# EAGLE design Controller (EAGLE 7.2.0)
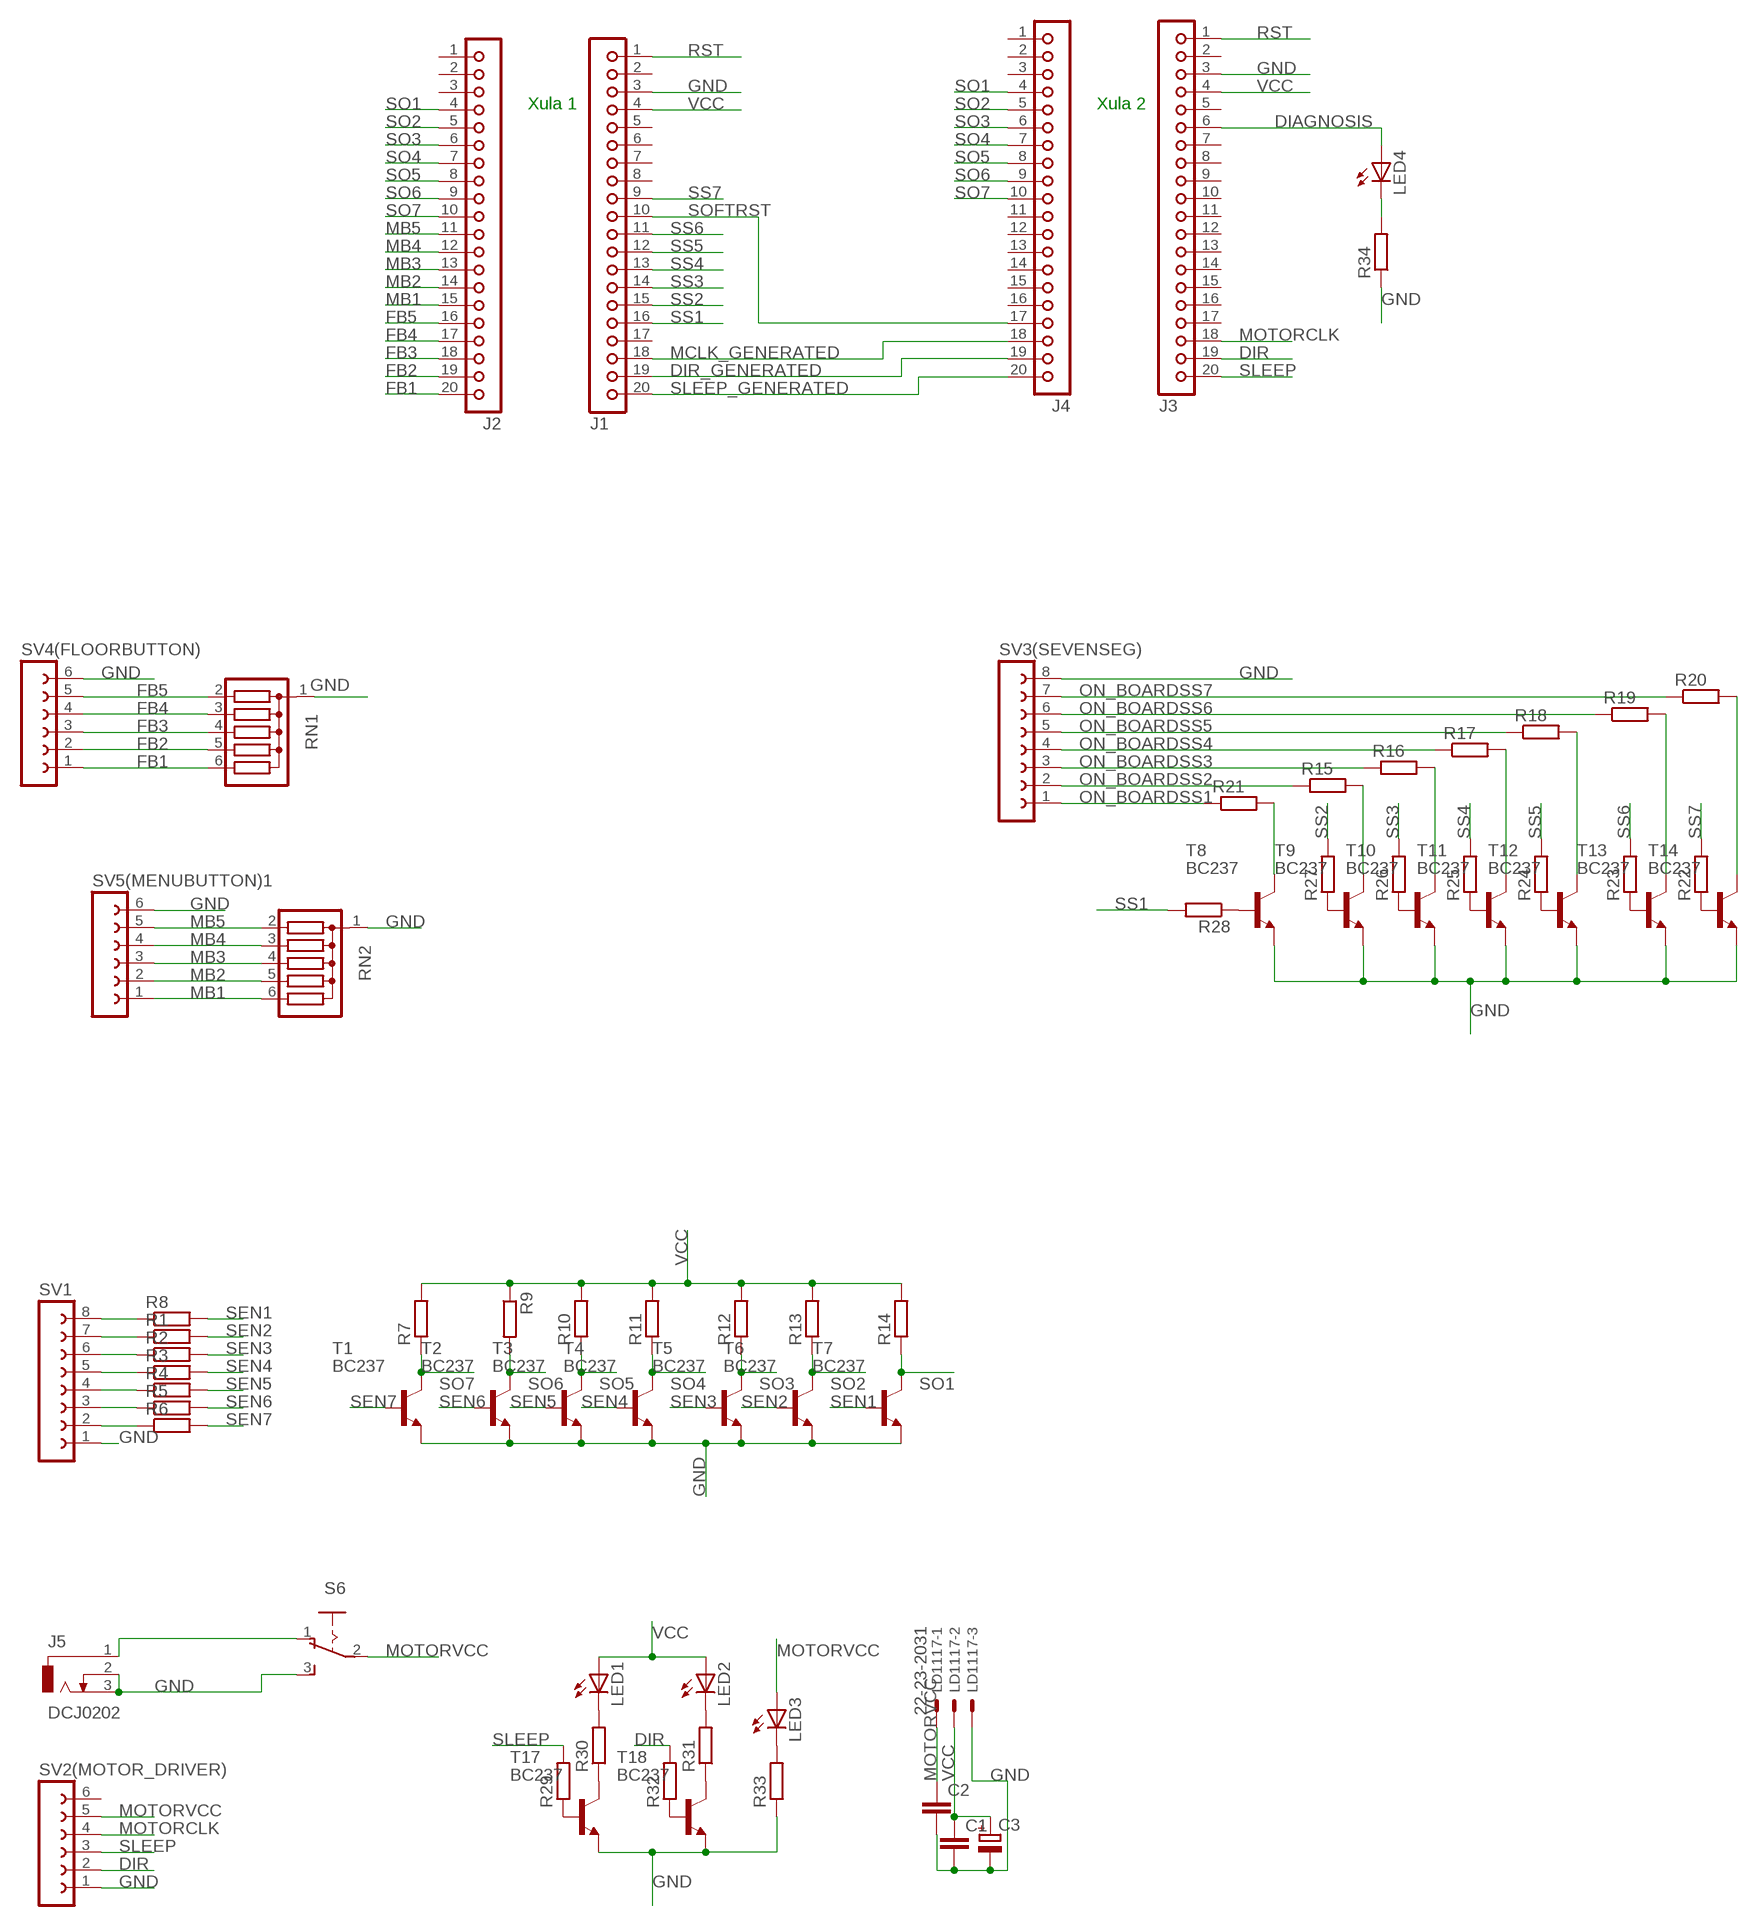
[diagram p0: schematic, sheet 1]

## Parts
C1  C-EU025-025X050  [C025-025X050]
C2  C-EU025-025X050  [C025-025X050]
C3  CPOL-EUE3.5-8  [E3,5-8]
J1  JBK20  [JBK20]
J2  JBK20  [JBK20]
J3  JBK20  [JBK20]
J4  JBK20  [JBK20]
J5  DCJ0202  [DCJ0202]
LD1117  22-23-2031  [22-23-2031]
LED1  LED3MM  [LED3MM]
LED2  LED3MM  [LED3MM]
LED3  LED3MM  [LED3MM]
LED4  LED3MM  [LED3MM]
R1  R-EU_0204/5  [0204/5]
R2  R-EU_0204/5  [0204/5]
R3  R-EU_0204/5  [0204/5]
R4  R-EU_0204/5  [0204/5]
R5  R-EU_0204/5  [0204/5]
R6  R-EU_0204/5  [0204/5]
R7  R-EU_0204/5  [0204/5]
R8  R-EU_0204/5  [0204/5]
R9  R-EU_0204/5  [0204/5]
R10  R-EU_0204/5  [0204/5]
R11  R-EU_0204/5  [0204/5]
R12  R-EU_0204/5  [0204/5]
R13  R-EU_0204/5  [0204/5]
R14  R-EU_0204/5  [0204/5]
R15  R-EU_0204/5  [0204/5]
R16  R-EU_0204/5  [0204/5]
R17  R-EU_0204/5  [0204/5]
R18  R-EU_0204/5  [0204/5]
R19  R-EU_0204/5  [0204/5]
R20  R-EU_0204/5  [0204/5]
R21  R-EU_0204/5  [0204/5]
R22  R-EU_0204/5  [0204/5]
R23  R-EU_0204/5  [0204/5]
R24  R-EU_0204/5  [0204/5]
R25  R-EU_0204/5  [0204/5]
R26  R-EU_0204/5  [0204/5]
R27  R-EU_0204/5  [0204/5]
R28  R-EU_0204/5  [0204/5]
R29  R-EU_0204/5  [0204/5]
R30  R-EU_0204/5  [0204/5]
R31  R-EU_0204/5  [0204/5]
R32  R-EU_0204/5  [0204/5]
R33  R-EU_0204/5  [0204/5]
R34  R-EU_0204/5  [0204/5]
RN1  G05R  [SIL6]
RN2  G05R  [SIL6]
S6  255SB  [255SB]
SV1  FE08-1  [FE08]
SV2(MOTOR_DRIVER)  FE06-1  [FE06]
SV3(SEVENSEG)  FE08W  [FE08W]
SV4(FLOORBUTTON)  FE06-1  [FE06]
SV5(MENUBUTTON)1  FE06-1  [FE06]
T1  BC237  [TO92]
T2  BC237  [TO92]
T3  BC237  [TO92]
T4  BC237  [TO92]
T5  BC237  [TO92]
T6  BC237  [TO92]
T7  BC237  [TO92]
T8  BC237  [TO92]
T9  BC237  [TO92]
T10  BC237  [TO92]
T11  BC237  [TO92]
T12  BC237  [TO92]
T13  BC237  [TO92]
T14  BC237  [TO92]
T17  BC237  [TO92]
T18  BC237  [TO92]

## Nets
DIAGNOSIS: J3.6 LED4.A
DIR: J3.19 R32.2 SV2(MOTOR_DRIVER).2
DIR_GENERATED: J1.19 J4.19
FB1: J2.20 RN1.6 SV4(FLOORBUTTON).1
FB2: J2.19 RN1.5 SV4(FLOORBUTTON).2
FB3: J2.18 RN1.4 SV4(FLOORBUTTON).3
FB4: J2.17 RN1.3 SV4(FLOORBUTTON).4
FB5: J2.16 RN1.2 SV4(FLOORBUTTON).5
GND: C1.2 C2.2 C3.- J1.3 J3.3 J5.2 J5.3 LD1117.3 R33.1 R34.1 RN1.1 RN2.1 S6.3(S) SV1.1 SV2(MOTOR_DRIVER).1 SV3(SEVENSEG).8 SV4(FLOORBUTTON).6 SV5(MENUBUTTON)1.6 T1.1(E) T2.1(E) T3.1(E) T4.1(E) T5.1(E) T6.1(E) T7.1(E) T8.1(E) T9.1(E) T10.1(E) T11.1(E) T12.1(E) T13.1(E) T14.1(E) T17.1(E) T18.1(E)
MB1: J2.15 RN2.6 SV5(MENUBUTTON)1.1
MB2: J2.14 RN2.5 SV5(MENUBUTTON)1.2
MB3: J2.13 RN2.4 SV5(MENUBUTTON)1.3
MB4: J2.12 RN2.3 SV5(MENUBUTTON)1.4
MB5: J2.11 RN2.2 SV5(MENUBUTTON)1.5
MCLK_GENERATED: J1.18 J4.18
MOTORCLK: J3.18 SV2(MOTOR_DRIVER).4
MOTORVCC: C2.1 LD1117.1 LED3.A S6.2(P) SV2(MOTOR_DRIVER).5
N$1: R2.1 SV1.6
N$2: R21.2 T8.3(C)
N$3: LED4.K(C) R34.2
N$4: R15.2 T9.3(C)
N$5: R16.2 T10.3(C)
N$6: R17.2 T11.3(C)
N$7: R18.2 T12.3(C)
N$8: R19.2 T13.3(C)
N$9: R5.1 SV1.3
N$10: R4.1 SV1.4
N$11: R3.1 SV1.5
N$12: R1.1 SV1.7
N$13: R8.1 SV1.8
N$14: R20.2 T14.3(C)
N$15: J5.1 S6.1(O)
N$16: R6.1 SV1.2
N$28: R22.1 T14.2(B)
N$29: R23.1 T13.2(B)
N$30: R24.1 T12.2(B)
N$31: R25.1 T11.2(B)
N$32: R26.1 T10.2(B)
N$33: R27.1 T9.2(B)
N$34: R28.1 T8.2(B)
N$35: R29.1 T17.2(B)
N$36: R30.1 T17.3(C)
N$37: R31.1 T18.3(C)
N$38: R32.1 T18.2(B)
N$39: LED3.K(C) R33.2
N$40: LED1.K(C) R30.2
N$41: LED2.K(C) R31.2
ON_BOARDSS1: R21.1 SV3(SEVENSEG).1
ON_BOARDSS2: R15.1 SV3(SEVENSEG).2
ON_BOARDSS3: R16.1 SV3(SEVENSEG).3
ON_BOARDSS4: R17.1 SV3(SEVENSEG).4
ON_BOARDSS5: R18.1 SV3(SEVENSEG).5
ON_BOARDSS6: R19.1 SV3(SEVENSEG).6
ON_BOARDSS7: R20.1 SV3(SEVENSEG).7
RST: J1.1 J3.1
SEN1: R8.2 T7.2(B)
SEN2: R1.2 T6.2(B)
SEN3: R2.2 T5.2(B)
SEN4: R3.2 T4.2(B)
SEN5: R4.2 T3.2(B)
SEN6: R5.2 T2.2(B)
SEN7: R6.2 T1.2(B)
SLEEP: J3.20 R29.2 SV2(MOTOR_DRIVER).3
SLEEP_GENERATED: J1.20 J4.20
SO1: J2.4 J4.4 R14.1 T7.3(C)
SO2: J2.5 J4.5 R13.1 T6.3(C)
SO3: J2.6 J4.6 R12.1 T5.3(C)
SO4: J2.7 J4.7 R11.1 T4.3(C)
SO5: J2.8 J4.8 R10.1 T3.3(C)
SO6: J2.9 J4.9 R9.2 T2.3(C)
SO7: J2.10 J4.10 R7.1 T1.3(C)
SOFTRST: J1.10 J4.17
SS1: J1.16 R28.2
SS2: J1.15 R27.2
SS3: J1.14 R26.2
SS4: J1.13 R25.2
SS5: J1.12 R24.2
SS6: J1.11 R23.2
SS7: J1.9 R22.2
VCC: C1.1 C3.+ J1.4 J3.4 LD1117.2 LED1.A LED2.A R7.2 R9.1 R10.2 R11.2 R12.2 R13.2 R14.2
Unconnected: J1.2 J1.5 J1.6 J1.7 J1.8 J1.17 J2.1 J2.2 J2.3 J3.2 J3.5 J3.7 J3.8 J3.9 J3.10 J3.11 J3.12 J3.13 J3.14 J3.15 J3.16 J3.17 J4.1 J4.2 J4.3 J4.11 J4.12 J4.13 J4.14 J4.15 J4.16 SV2(MOTOR_DRIVER).6

## Notes on the sheet
- Xula 1 | Xula 2

## Library data of the parts
C1 C2 = rcl:C-EU: CAPACITOR, European symbol
C3 = rcl:CPOL-EU: POLARIZED CAPACITOR, European symbol
J1-J4 = con-lsta:JBK20: PIN HEADER; OC_FARNELL: unknown; OC_NEWARK: unknown
J5 = con-jack:DCJ0202: DC POWER JACK Source: DCJ0202.pdf; OC_FARNELL: unknown; OC_NEWARK: unknown
LD1117 = con-molex:22-23-2031: .100" (2.54mm) Center Header - 3 Pin; MF: MOLEX; MPN: 22-23-2031; OC_FARNELL: 1462950; OC_NEWARK: 30C0862
LED1-LED4 = led:LED: LED OSRAM: - CHIPLED LG R971, LG N971, LY N971, LG Q971, LY Q971, LO R971, LY R971 LH N974, LH R974 LS Q976, LO Q976, LY Q976 LO Q996 - Hyper CHIPLED LW Q18S LB Q993, LB Q99A, LB R99A - SideLED LS A670, LO A670, LY A670, LG A670, LP A670 LB A673, LV A673, LT A673, LW A673 LH A674 LY A675 LS A676, LA A676, LO A676, LY A676, LW A676 LS A679, LY A679, LG A679 - Hyper Micro SIDELED® LS Y876, LA Y876, LO Y876, LY Y876 LT Y87S - SmartLED LW L88C, LW L88S LB L89C, LB L89S, LG L890 LS L89K, LO L89K, LY L89K LS L896, LA L896, LO L896, LY L896 - TOPLED LS T670, LO T670, LY T670, LG T670, LP T670 LSG T670, LSP T670, LSY T670, LOP T670, LYG T670 LG T671, LOG T671, LSG T671 LB T673, LV T673, LT T673, LW T673 LH T674 LS T676, LA T676, LO T676, LY T676, LB T676, LH T676, LSB T676, LW T676 LB T67C, LV T67C, LT T67C, LS T67K, LO T67K, LY T67K, LW E67C LS E67B, LA E67B, LO E67B, LY E67B, LB E67C, LV E67C, LT E67C LW T67C LS T679, LY T679, LG T679 LS T770, LO T770, LY T770, LG T770, LP T770 LB T773, LV T773, LT T773, LW T773 LH T774 LS E675, LA E675, LY E675, LS T675 LS T776, LA T776, LO T776, LY T776, LB T776 LHGB T686 LT T68C, LB T68C - Hyper Mini TOPLED® LB M676 - Mini TOPLED Santana® LG M470 LS M47K, LO M47K, LY M47K Source: http://www.osram.convergy.de LUXEON: - LUMILED® LXK2-PW12-R00, LXK2-PW12-S00, LXK2-PW14-U00, LXK2-PW14-V00 LXK2-PM12-R00, LXK2-PM12-S00, LXK2-PM14-U00 LXK2-PE12-Q00, LXK2-PE12-R00, LXK2-PE12-S00, LXK2-PE14-T00, LXK2-PE14-U00 LXK2-PB12-K00, LXK2-PB12-L00, LXK2-PB12-M00, LXK2-PB14-N00, LXK2-PB14-P00, LXK2-PB14-Q00 LXK2-PR12-L00, LXK2-PR12-M00, LXK2-PR14-Q00, LXK2-PR14-R00 LXK2-PD12-Q00, LXK2-PD12-R00, LXK2-PD12-S00 LXK2-PH12-R00, LXK2-PH12-S00 LXK2-PL12-P00, LXK2-PL12-Q00, LXK2-PL12-R00 Source: www.luxeon.com KINGBRIGHT: KA-3528ASYC Source: www.kingbright.com
R1-R34 = rcl:R-EU_: RESISTOR, European symbol
RN1 RN2 = resistor-sil:G05R: SIL RESISTOR; OC_FARNELL: unknown; OC_NEWARK: unknown
S6 = switch:255SB: SLIDING SWITCH Distributor Buerklin, 11G810
SV1 = con-lsta:FE08-1: FEMALE HEADER; OC_FARNELL: unknown; OC_NEWARK: unknown
SV2(MOTOR_DRIVER) SV4(FLOORBUTTON) SV5(MENUBUTTON)1 = con-lsta:FE06-1: FEMALE HEADER; OC_FARNELL: unknown; OC_NEWARK: unknown
SV3(SEVENSEG) = con-lsta:FE08W: FEMALE HEADER; OC_FARNELL: unknown; OC_NEWARK: unknown
T1-T14 T17 T18 = transistor-neu-to92:BC237: NPN TRANSISTOR

## Net classes
0 default: clearance 0.205 mm

## Board
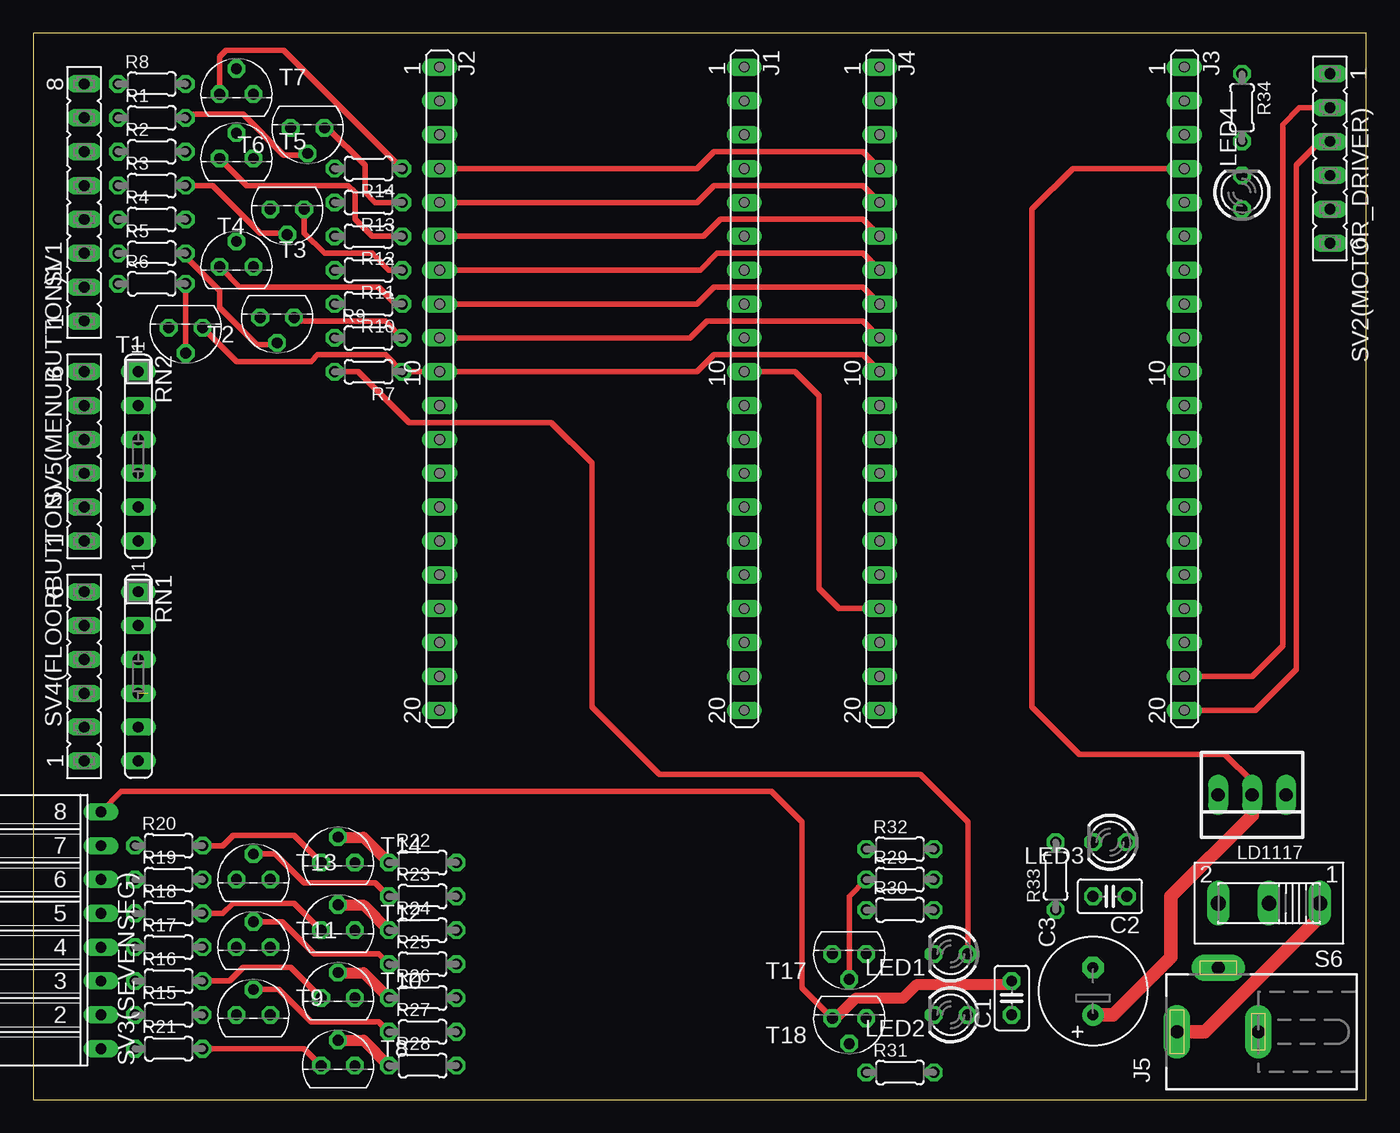
[diagram p1: board, top side]
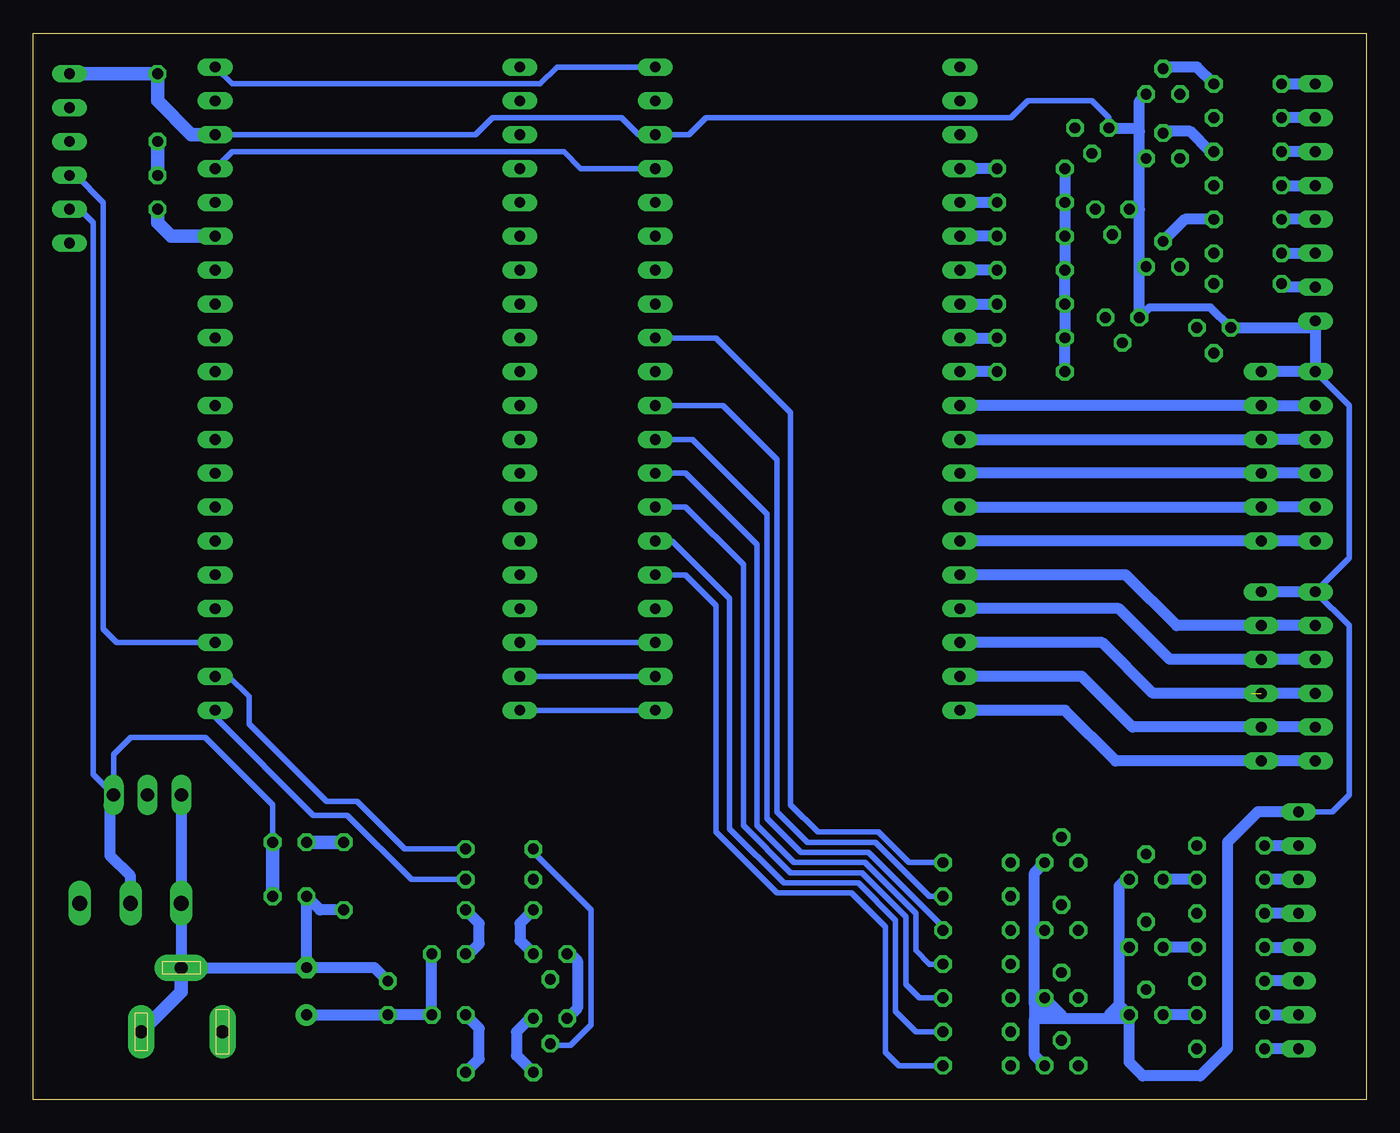
[diagram p2: board, bottom side, seen from below]

Size 100 x 80 mm. Coordinates in mm from the lower left corner, seen from the top.
Outline: 0,0 100,0 100,80 0,80 0,0
Copper layers (1*16): Top 0.035mm / dielectric 1.5mm / Bottom 0.035mm
Design rules "default": minimum track width 10mil, minimum drill 24mil, track to track 8mil, track to pad 8mil, pad to pad 8mil, via to via 8mil, smd to smd 8mil, copper to edge 40mil, drill to drill 8mil, minimum pad ring 10mil, minimum via ring 8mil, stop-mask expansion 4mil, vias tented up to drill 0mil, thermal gap 10mil

### Footprints (pad centres in the part's own frame; a part is rotated, then mirrored left to right if it is on the bottom)
C025-025X050 = drill 0.813 octagon: 1 -1.27,0; 2 1.27,0
E3,5-8 = drill 0.813 pad 1.6: + -1.778,0 | drill 0.813 pad 1.6 octagon: - 1.778,0
JBK20 = drill 0.813 long: 1 -24.13,0; 2 -21.59,0; 3 -19.05,0; 4 -16.51,0; 5 -13.97,0; 6 -11.43,0; 7 -8.89,0; 8 -6.35,0; 9 -3.81,0; 10 -1.27,0; 11 1.27,0; 12 3.81,0; 13 6.35,0; 14 8.89,0; 15 11.43,0; 16 13.97,0; 17 16.51,0; 18 19.05,0; 19 21.59,0; 20 24.13,0
DCJ0202 = drill 1 pad 2 long: 1 0,3.1; 2 4.8,0; 3 0,-3
22-23-2031 = drill 1 long: 1 -2.54,0; 2 0,0; 3 2.54,0
LED3MM = drill 0.813 octagon: A -1.27,0; K 1.27,0
0204/5 = drill 0.813 octagon: 1 -2.54,0; 2 2.54,0
SIL6 = drill 0.813 long: 1 -6.35,0; 2 -3.81,0; 3 -1.27,0; 4 1.27,0; 5 3.81,0; 6 6.35,0
255SB = drill 1.118 long: 1 -3.81,0; 2 0,0; 3 3.81,0
FE08 = drill 0.813 long: 1 -8.89,0; 2 -6.35,0; 3 -3.81,0; 4 -1.27,0; 5 1.27,0; 6 3.81,0; 7 6.35,0; 8 8.89,0
FE06 = drill 0.813 long: 1 -6.35,0; 2 -3.81,0; 3 -1.27,0; 4 1.27,0; 5 3.81,0; 6 6.35,0
FE08W = drill 0.813 long: 1 -8.89,0; 2 -6.35,0; 3 -3.81,0; 4 -1.27,0; 5 1.27,0; 6 3.81,0; 7 6.35,0; 8 8.89,0
TO92 = drill 0.813 octagon: 1 1.27,0; 2 0,1.905; 3 -1.27,0

### Placement (x,y rotation side)
C1  73.41,7.62 90 top
C2  80.77,15.24 180 top
C3  79.5,8.13 90 top
J1  53.34,53.34 270 top
J2  30.48,53.34 270 top
J3  86.36,53.34 270 top
J4  63.5,53.34 270 top
J5  88.9,5.08 90 top
LD1117  91.44,22.86 180 top
LED1  68.83,10.92 180 top
LED2  68.83,6.35 180 top
LED3  80.77,19.3 180 top
LED4  90.68,68.07 90 top
R1  8.89,73.66 0 top
R2  8.89,71.12 0 top
R3  8.89,68.58 0 top
R4  8.89,66.04 0 top
R5  8.89,63.5 0 top
R6  8.89,61.21 0 top
R7  25.15,54.61 180 top
R8  8.89,76.2 0 top
R9  25.15,57.15 0 top
R10  25.15,59.69 180 top
R11  25.15,62.23 180 top
R12  25.15,64.77 180 top
R13  25.15,67.31 180 top
R14  25.15,69.85 180 top
R15  10.16,6.35 0 top
R16  10.16,8.89 0 top
R17  10.16,11.43 0 top
R18  10.16,13.97 0 top
R19  10.16,16.51 0 top
R20  10.16,19.05 0 top
R21  10.16,3.81 0 top
R22  29.21,17.78 0 top
R23  29.21,15.24 0 top
R24  29.21,12.7 0 top
R25  29.21,10.16 0 top
R26  29.21,7.62 0 top
R27  29.21,5.08 0 top
R28  29.21,2.54 0 top
R29  65.02,16.51 0 top
R30  65.02,14.22 0 top
R31  65.02,2.03 0 top
R32  65.02,18.8 0 top
R33  76.71,16.76 90 top
R34  90.68,74.42 270 top
RN1  7.87,31.75 270 top
RN2  7.87,48.26 270 top
S6  92.71,14.73 180 top
SV1  3.81,67.31 90 top
SV2(MOTOR_DRIVER)  97.28,70.61 270 top
SV3(SEVENSEG)  5.08,12.7 90 top
SV4(FLOORBUTTON)  3.81,31.75 90 top
SV5(MENUBUTTON)1  3.81,48.26 90 top
T1  11.43,57.91 180 top
T2  18.29,58.67 180 top
T3  15.24,62.48 0 top
T4  19.05,66.8 180 top
T5  15.24,70.61 0 top
T6  20.57,72.9 180 top
T7  15.24,75.44 0 top
T8  22.86,2.54 0 top
T9  16.51,6.35 0 top
T10  22.86,7.62 0 top
T11  16.51,11.43 0 top
T12  22.86,12.7 0 top
T13  16.51,16.51 0 top
T14  22.86,17.78 0 top
T17  61.21,10.92 180 top
T18  61.21,6.1 180 top

### Tracks (layer width: path | path; a pad name or v marks a point on that pad's centre or on a via)
DIAGNOSIS
  Bottom 1.016: LED4.A 90.68,65.79 89.66,64.77 J3.6
DIR
  Top 0.406: J3.19 91.44,31.75 93.73,34.04 93.73,73.15 95,74.42 SV2(MOTOR_DRIVER).2 98.04,74.42
  Bottom 0.406: R32.2 72.14,18.8 75.69,22.35 77.98,22.35 83.82,28.19 83.82,30.23 85.34,31.75 J3.19
DIR_GENERATED
  Bottom 0.406: J4.19 J1.19
FB1
  Bottom 0.813: SV4(FLOORBUTTON).1 RN1.6 18.8,25.4 22.61,29.21 J2.20
FB2
  Bottom 0.813: SV4(FLOORBUTTON).2 RN1.5 17.53,27.94 21.34,31.75 J2.19
FB3  (1 unrouted)
  Bottom 0.813: SV4(FLOORBUTTON).3 RN1.4 | RN1.4 8.64,30.48 | RN1.4 16,30.48 19.81,34.29 J2.18
FB4
  Bottom 0.813: SV4(FLOORBUTTON).4 RN1.3 14.73,33.02 18.54,36.83 J2.17
FB5
  Bottom 0.813: SV4(FLOORBUTTON).5 RN1.2 14.22,35.56 18.03,39.37 J2.16
GND
  Top 0.406: SV3(SEVENSEG).8 6.6,23.11 55.37,23.11 57.66,20.83 57.66,8.38 T18.1
  Top 0.813: T18.1 60.2,6.1 61.72,7.62 65.28,7.62 66.29,8.64 73.15,8.64 C1.2
  Bottom 0.406: SV5(MENUBUTTON)1.6 1.27,52.07 1.27,40.64 SV4(FLOORBUTTON).6 1.27,35.56 1.27,22.86 2.54,21.59 SV3(SEVENSEG).8 | 59.18,6.86 59.18,10.16 T17.1 | J3.3 66.8,72.39 65.53,73.66 55.88,73.66 54.61,72.39 J1.3 50.8,72.39 49.53,73.66 26.67,73.66 25.4,74.93 20.57,74.93 19.3,73.66 T6.1
  Bottom 0.61: T1.1 11.68,59.44 16.26,59.44 T2.1
  Bottom 0.813: SV4(FLOORBUTTON).6 RN1.1 | RN2.1 SV5(MENUBUTTON)1.6 SV1.1 4.32,57.91 T1.1 | T13.1 18.03,16.51 18.54,16 18.54,11.43 | 18.54,11.43 18.54,7.11 | T11.1 18.54,11.43 | T8.1 24.89,3.3 24.89,6.1 | 24.89,7.11 24.89,7.37 | 24.89,7.37 24.89,12.45 | 24.89,12.45 24.89,17.02 T14.1 | T12.1 24.64,12.7 24.89,12.45 | 24.38,7.62 24.64,7.62 24.89,7.37 | T9.1 19.3,6.35 18.54,7.11 | 24.38,7.62 24.89,7.11 | 24.89,7.11 24.89,6.1 | 24.89,6.1 18.03,6.1 T9.1 | T9.1 18.54,7.11 | 24.38,6.35 24.38,7.11 23.62,6.35 22.86,6.35 T10.1 24.38,7.62 | SV3(SEVENSEG).8 8.13,21.59 10.41,19.3 10.41,3.81 12.45,1.78 16.76,1.78 17.78,2.79 T9.1 | T2.1 17.02,62.48 | 17.02,62.48 17.02,66.8 | 17.02,66.8 17.02,70.61 | 17.02,70.61 17.02,72.64 | 17.02,72.64 17.02,74.93 T7.1 | T5.1 17.02,70.61 | T4.1 17.02,66.8 | T3.1 17.02,62.48 | T6.1 17.27,72.9 17.02,72.64 | LD1117.3 S6.3 J5.2 79.53,9.88 C3.- | C3.- C2.2 78.49,14.22 R33.1 | C3.- 74.42,9.91 C1.2 | T17.1 59.69,10.92 59.18,10.41 59.18,6.86 T18.1
  Bottom 1.016: J5.2 88.9,8.08 J5.3 | J3.3 88.14,72.39 90.68,74.93 R34.1 SV2(MOTOR_DRIVER).1
MB1
  Bottom 0.813: SV5(MENUBUTTON)1.1 RN2.6 J2.15
MB2
  Bottom 0.813: SV5(MENUBUTTON)1.2 RN2.5 J2.14
MB3
  Bottom 0.813: SV5(MENUBUTTON)1.3 RN2.4 J2.13
MB4
  Bottom 0.813: SV5(MENUBUTTON)1.4 RN2.3 J2.12
MB5
  Bottom 0.813: J2.11 RN2.2 SV5(MENUBUTTON)1.5
MCLK_GENERATED
  Bottom 0.406: J1.18 J4.18
MOTORCLK
  Bottom 0.406: SV2(MOTOR_DRIVER).4 96.77,69.34 94.74,67.31 94.74,35.31 93.73,34.29 J3.18
MOTORVCC
  Bottom 0.406: C2.1 82.04,22.1 87.12,27.18 92.71,27.18 93.98,25.91 LD1117.1 95.5,24.38 95.5,65.79 96.52,66.8 SV2(MOTOR_DRIVER).5
  Bottom 0.813: S6.2 92.71,16.76 94.23,18.29 94.23,22.61 LD1117.1
  Bottom 1.016: LED3.A C2.1
N$1
  Bottom 0.813: SV1.6 R2.1
N$2
  Top 0.406: R21.2 20.32,3.81 T8.3
N$3
  Bottom 1.016: R34.2 LED4.K
N$4
  Bottom 0.813: R15.2 T9.3
N$5
  Top 0.406: R16.2 14.73,8.89 15.75,9.91 19.3,9.91 T10.3
N$6
  Bottom 0.813: R17.2 T11.3
N$7
  Top 0.406: R18.2 14.22,13.97 14.99,14.73 19.56,14.73 T12.3
N$8
  Bottom 0.813: R19.2 T13.3
N$9
  Bottom 0.813: R5.1 SV1.3
N$10
  Bottom 0.813: SV1.4 R4.1
N$11
  Bottom 0.813: R3.1 SV1.5
N$12
  Bottom 0.813: SV1.7 R1.1
N$13
  Bottom 0.813: R8.1 SV1.8
N$14
  Top 0.406: R20.2 14.22,19.05 14.99,19.81 19.56,19.81 T14.3
N$15
  Top 1.016: J5.1 87.88,5.08 96.52,13.72 S6.1
N$16
  Bottom 0.813: SV1.2 6.1,60.96 R6.1
N$28
  Top 0.813: T14.2 24.77,19.68 R22.1
N$29
  Top 0.406: T13.2 18.16,18.41 20.32,16.26 25.65,16.26 R23.1
N$30
  Top 0.813: T12.2 24.77,14.61 R24.1
N$31
  Top 0.406: T11.2 18.67,13.34 21.08,10.92 25.91,10.92 R25.1
N$32
  Top 0.813: T10.2 24.77,9.53 R26.1
N$33
  Top 0.406: T9.2 18.41,8.26 20.83,5.84 25.91,5.84 R27.1
N$34
  Top 0.813: T8.2 24.77,4.45 R28.1
N$35
  Top 0.406: T17.2 61.21,15.24 R29.1
N$36
  Bottom 0.813: R30.1 62.48,13.97 62.74,13.97 63.5,13.21 63.5,11.94 T17.3
N$37
  Bottom 0.813: T18.3 62.74,6.1 63.75,5.08 63.75,3.3 R31.1
N$38
  Bottom 0.406: R32.1 62.48,18.54 58.17,14.22 58.17,5.59 59.69,4.06 61.09,4.06 T18.2
N$39
  Bottom 1.016: LED3.K R33.2
N$40
  Bottom 0.813: LED1.K 67.56,10.67 66.55,11.68 66.55,13.21 R30.2
N$41
  Bottom 0.813: R31.2 66.55,3.05 66.55,5.33 LED2.K
ON_BOARDSS1
  Bottom 0.813: SV3(SEVENSEG).1 R21.1
ON_BOARDSS2
  Bottom 0.813: R15.1 SV3(SEVENSEG).2
ON_BOARDSS3
  Bottom 0.813: SV3(SEVENSEG).3 R16.1
ON_BOARDSS4
  Bottom 0.813: R17.1 SV3(SEVENSEG).4
ON_BOARDSS5
  Bottom 0.813: SV3(SEVENSEG).5 R18.1
ON_BOARDSS6
  Bottom 0.813: SV3(SEVENSEG).6 R19.1
ON_BOARDSS7
  Bottom 0.813: SV3(SEVENSEG).7 R20.1
RST
  Bottom 0.406: J1.1 60.71,77.47 61.98,76.2 85.09,76.2 J3.1
SEN1
  Bottom 0.813: R8.2 12.7,77.47 15.11,77.47 T7.2
SEN2
  Top 0.406: R1.2 11.68,73.91 15.75,73.91 18.8,70.87 20.45,70.87 T6.2
SEN3
  Bottom 0.813: R2.2 11.68,71.12 13.21,72.64 15.11,72.64 T5.2
SEN4
  Top 0.406: R3.2 13.46,68.58 17.02,65.02 18.92,65.02 T4.2
SEN5
  Bottom 0.813: R4.2 13.59,66.04 T3.2
SEN6
  Top 0.406: R5.2 11.43,63.25 13.97,60.71 13.97,59.44 16.76,56.64 18.16,56.64 T2.2
SEN7
  Top 0.406: R6.2 T1.2
SLEEP
  Top 0.406: SV2(MOTOR_DRIVER).3 96.52,71.88 94.74,70.1 94.74,32.26 91.69,29.21 J3.20
  Bottom 0.406: J3.20 86.36,28.7 78.99,21.34 76.45,21.34 71.63,16.51 R29.2
SLEEP_GENERATED
  Bottom 0.406: J1.20 J4.20
SO1
  Top 0.406: J2.4 49.78,69.85 51.05,71.12 62.23,71.12 J4.4 | T7.3 13.97,78.23 14.48,78.74 18.8,78.74 R14.1
  Bottom 0.813: R14.1 J2.4
SO2
  Top 0.406: J2.5 49.78,67.31 51.05,68.58 62.23,68.58 J4.5 | T6.3 22.1,72.9 24.89,70.1 24.89,68.07 25.65,67.31 R13.1
  Bottom 0.813: R13.1 J2.5
SO3
  Top 0.406: J2.6 50.29,64.77 51.56,66.04 62.23,66.04 J4.6 | R12.1 25.4,64.77 24.13,66.04 24.13,68.07 23.62,68.58 16,68.58 T5.3
  Bottom 0.813: R12.1 J2.6
SO4
  Top 0.406: J2.7 50.04,62.23 51.31,63.5 62.23,63.5 J4.7 | T4.3 20.32,65.02 21.84,63.5 25.4,63.5 26.67,62.23 R11.1
  Bottom 0.813: R11.1 J2.7
SO5
  Top 0.406: J2.8 49.78,59.69 51.05,60.96 62.23,60.96 J4.8 | R10.1 27.18,59.69 25.91,60.96 15.49,60.96 T3.3
  Bottom 0.813: J2.8 R10.1
SO6
  Top 0.406: T2.3 19.81,58.42 26.42,58.42 R9.2 | J2.9 49.28,57.15 50.55,58.42 62.23,58.42 J4.9
  Bottom 0.813: J2.9 R9.2
SO7
  Top 0.406: J4.10 62.23,55.88 51.05,55.88 49.78,54.61 R7.1 26.42,55.88 21.34,55.88 20.83,55.37 15.24,55.37 T1.3
  Bottom 0.813: R7.1 J2.10
SOFTRST
  Top 0.406: J1.10 57.15,54.61 58.93,52.83 58.93,38.35 60.45,36.83 J4.17
SS1
  Bottom 0.406: R28.2 35.05,2.54 36.07,3.56 36.07,12.95 38.61,15.49 44.2,15.49 48.77,20.07 48.77,37.08 51.05,39.37 J1.16
SS2
  Bottom 0.406: J1.15 52.07,41.91 47.75,37.59 47.75,20.32 43.69,16.26 38.1,16.26 35.31,13.46 35.31,6.6 33.78,5.08 R27.2
SS3
  Bottom 0.406: R26.2 33.53,7.62 34.54,8.64 34.54,13.72 37.85,17.02 43.18,17.02 46.74,20.57 46.74,40.13 51.05,44.45 J1.14
SS4
  Bottom 0.406: R25.2 32.77,10.16 33.78,11.18 33.78,13.97 37.59,17.78 42.93,17.78 45.72,20.57 45.72,41.66 51.05,46.99 J1.13
SS5
  Bottom 0.406: R24.2 31.75,12.95 37.34,18.54 42.42,18.54 44.96,21.08 44.96,43.94 50.55,49.53 J1.12
SS6
  Bottom 0.406: R23.2 32.77,15.24 36.83,19.3 41.91,19.3 44.2,21.59 44.2,48.01 48.26,52.07 J1.11
SS7
  Bottom 0.406: R22.2 34.29,17.78 36.58,20.07 41.15,20.07 43.18,22.1 43.18,51.56 48.77,57.15 J1.9
VCC
  Top 0.406: R7.2 24.38,54.61 28.19,50.8 38.86,50.8 41.91,47.75 41.91,29.46 46.99,24.38 66.55,24.38 70.1,20.83 LED1.A | J3.4 77.98,69.85 74.93,66.8 74.93,29.46 78.49,25.91 89.41,25.91 91.44,23.88 LD1117.2
  Top 1.016: C3.+ 81.03,6.35 85.34,10.67 85.34,15.24 91.44,21.34 LD1117.2
  Bottom 0.406: J1.4 58.93,69.85 60.2,71.12 85.09,71.12 J3.4
  Bottom 0.813: R14.2 R13.2 R12.2 R11.2 R10.2 R9.1 R7.2 | C3.+ C1.1 LED2.A LED1.A